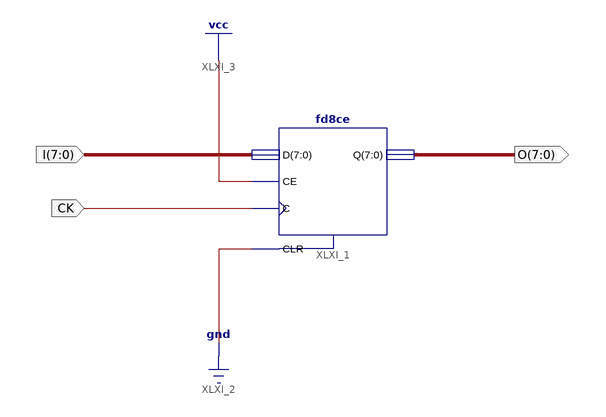
[diagram p0: schematic sheet 1]
// Xilinx ISE schematic fd8.sch (spartan2e) as structural Verilog: 1 symbols, 3 ports
module fd8 (
  input  [7:0] I,
  input  CK,
  output [7:0] O
);

  fd8ce XLXI_1 (.C(CK), .CE(1'b1), .CLR(1'b0), .D(I), .Q(O));
endmodule
